# EAGLE design JediLightSwitch-V1.1 (EAGLE 7.4.0)
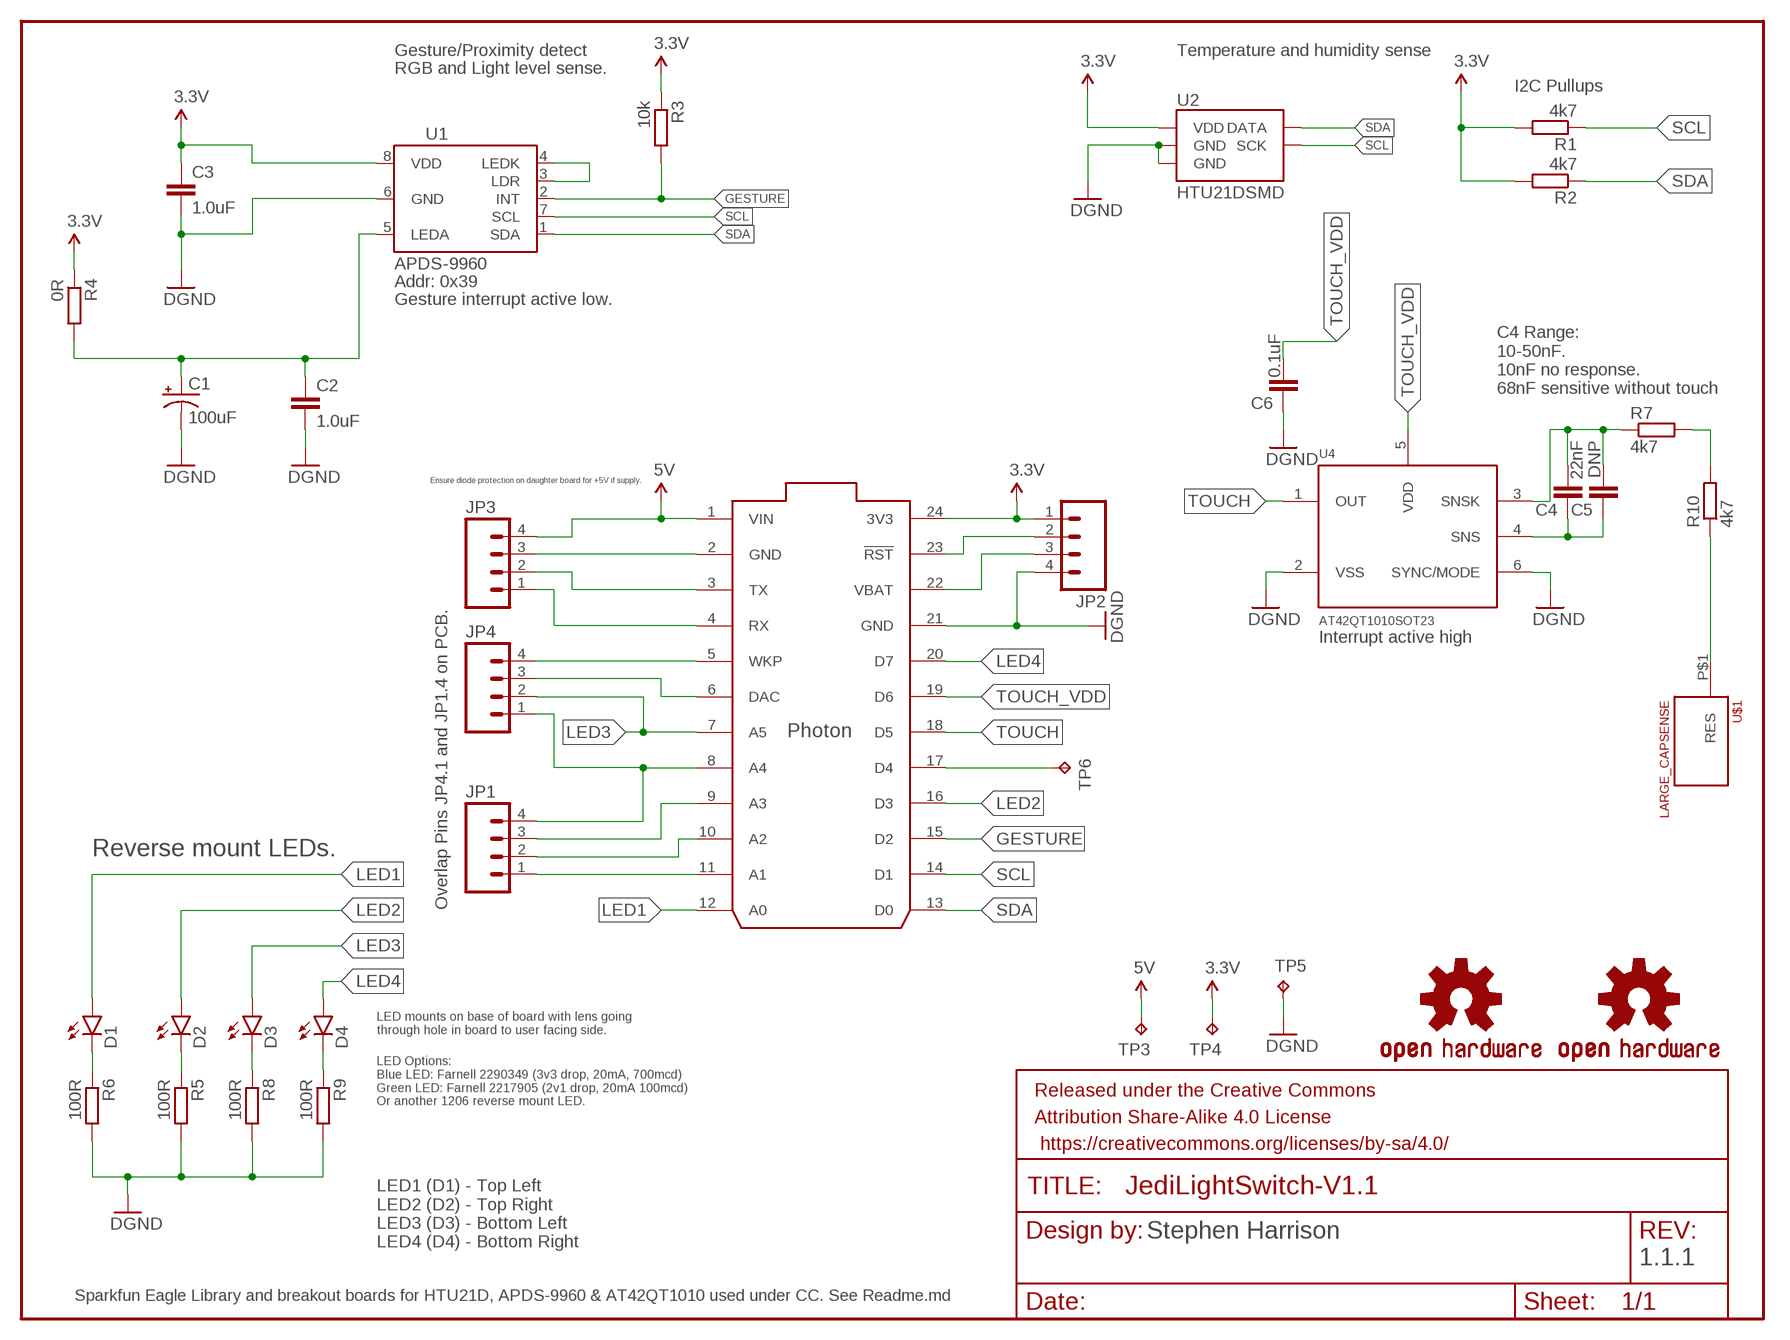
[diagram p0: schematic, sheet 1]

## Parts
C1  100uF  100UF-10V-10%(TANT)  [EIA7343]
C2  1.0uF  C-EUC0805  [C0805]
C3  1.0uF  C-EUC0805  [C0805]
C4  22nF  C-EUC0805  [C0805]
C5  DNP  C-EUC0805  [C0805]
C6  0.1uF  C-EUC0805  [C0805]
D1  LED1206-BOTTOM  [LED-1206-BOTTOM]
D2  LED1206-BOTTOM  [LED-1206-BOTTOM]
D3  LED1206-BOTTOM  [LED-1206-BOTTOM]
D4  LED1206-BOTTOM  [LED-1206-BOTTOM]
FRAME2  FRAME-LETTER  [CREATIVE_COMMONS]
JP1  M04SMD_STRAIGHT_COMBO  [1X04_SMD_STRAIGHT_COMBO]
JP2  M04SMD_STRAIGHT_COMBO  [1X04_SMD_STRAIGHT_COMBO]
JP3  M04SMD_STRAIGHT_COMBO  [1X04_SMD_STRAIGHT_COMBO]
JP4  M04SMD_STRAIGHT_COMBO  [1X04_SMD_STRAIGHT_COMBO]
LOGO1  OSHW-LOGOM  [OSHW-LOGO-M]
LOGO2  OSHW-LOGOM  [OSHW-LOGO-M]
R1  4k7  R-EU_R0805  [R0805]
R2  4k7  R-EU_R0805  [R0805]
R3  10k  R-EU_R0805  [R0805]
R4  0R  R-EU_R0805  [R0805]
R5  100R  R-EU_R0805  [R0805]
R6  100R  R-EU_R0805  [R0805]
R7  4k7  R-EU_R0805  [R0805]
R8  100R  R-EU_R0805  [R0805]
R9  100R  R-EU_R0805  [R0805]
R10  4k7  R-EU_R0805  [R0805]
TP3  TPTP20R  [TP20R]
TP4  3v3  TPTP20R  [TP20R]
TP5  TPTP20R  [TP20R]
TP6  TPTP20R  [TP20R]
U1  APDS-9960  [APDS-9960]
U2  HTU21DSMD  [HTU21D]
U3  PHOTON_SMD  [PHOTON_SMD]
U4  AT42QT1010SOT23  [SOT23-6]
U$1  LARGE_CAPSENSE  [LARGE_CAPSENSE]

## Nets
3.3V: C3.1 JP2.1 R1.2 R2.2 R3.1 R4.1 TP4.TP U1.8(VDD) U2.VDD U3.24(3V3)
5V: JP3.4 TP3.TP U3.1(VIN)
GESTURE: R3.2 U1.2(INT) U3.15(D2)
GND: C1.C(-) C2.2 C3.2 C6.1 JP2.4 JP3.3 R5.2 R6.2 R8.2 R9.2 TP5.TP U1.6(GND) U2.7(GND) U2.GND U3.2(GND) U3.21(GND) U4.2(VSS) U4.6(SYNC/MODE) ; supply symbol labelled DGND
LED1: D1.A U3.12(A0)
LED2: D2.A U3.16(D3)
LED3: D3.A JP4.2 U3.7(A5)
LED4: D4.A U3.20(D7)
N$1: U1.3(LDR) U1.4(LEDK)
N$2: C1.A(+) C2.1 R4.2 U1.5(LEDA)
N$3: D2.C R5.1
N$4: D1.C R6.1
N$5: JP2.2 U3.23(!RST)
N$6: JP1.1 U3.11(A1)
N$7: JP2.3 U3.22(VBAT)
N$8: R7.2 R10.2
N$9: R10.1 U$1.P$1(RES)
N$10: JP4.4 U3.5(WKP)
N$11: JP1.2 U3.10(A2)
N$12: JP1.3 U3.9(A3)
N$13: JP1.4 JP4.1 U3.8(A4)
N$14: JP3.1 U3.4(RX)
N$15: JP3.2 U3.3(TX)
N$16: JP4.3 U3.6(DAC)
N$19: C4.2 C5.2 R7.1 U4.3(SNSK)
N$20: C4.1 C5.1 U4.4(SNS)
N$22: TP6.TP U3.17(D4)
N$30: D3.C R8.1
N$31: D4.C R9.1
SCL: R1.1 U1.7(SCL) U2.SCK U3.14(D1)
SDA: R2.1 U1.1(SDA) U2.DATA U3.13(D0)
TOUCH: U3.18(D5) U4.1(OUT)
TOUCH_VDD: C6.2 U3.19(D6) U4.5(VDD)
Unconnected: U3.25(EN) U3.26(!SETUP) U3.27(RGB_RED) U3.28(RGB_GREEN) U3.29(RGB_BLUE) U3.30(USB_D-) U3.31(USB_D+)

## Notes on the sheet
- Gesture/Proximity detect | Temperature and humidity sense
- RGB and Light level sense.
- I2C Pullups
- Addr: 0x39
- Gesture interrupt active low.
- C4 Range: 
  10-50nF. 
  10nF no response.
  68nF sensitive without touch
- Ensure diode protection on daughter board for +5V if supply.
- Interrupt active high
- Reverse mount LEDs.
- Overlap Pins JP4.1 and JP1.4 on PCB.
- LED mounts on base of board with lens going 
  through hole in board to user facing side.
- LED Options:
  Blue LED: Farnell 2290349 (3v3 drop, 20mA, 700mcd)
  Green LED: Farnell 2217905 (2v1 drop, 20mA 100mcd)
  Or another 1206 reverse mount LED.
- Stephen Harrison
- LED1 (D1) - Top Left
  LED2 (D2) - Top Right
  LED3 (D3) - Bottom Left
  LED4 (D4) - Bottom Right
- 1.1.1
- Sparkfun Eagle Library and breakout boards for HTU21D, APDS-9960 & AT42QT1010 used under CC. See Readme.md

## Library data of the parts
C1 = SparkFun-Capacitors:100UF-10V-10%(TANT): CAP-07890; FARNELL: 1754094; PROD_ID: CAP-07890
C2 C3 = rcl:C-EU: CAPACITOR, European symbol; FARNELL: 2320853
C4 = rcl:C-EU: CAPACITOR, European symbol; FARNELL: 2320841
C5 C6 = rcl:C-EU: CAPACITOR, European symbol
D1-D4 = SparkFun-LED:LED: LEDs Standard schematic elements and footprints for 5mm, 3mm, 1206, and 0603 sized LEDs. 5mm - Spark Fun Electronics SKU : COM-00529 (and others); FARNELL: 2290349
FRAME2 = SparkFun-Aesthetics:FRAME-LETTER: Schematic Frame Standard 8.5x11 US Letter frame
JP1-JP4 = SparkFun-Connectors:M04: Header 4 Standard 4-pin 0.1" header. Use with straight break away headers (SKU : PRT-00116), right angle break away headers (PRT-00553), swiss pins (PRT-00743), machine pins (PRT-00117), and female headers (PRT-00115). Molex polarized connector foot print use with SKU : PRT-08231 with associated crimp pins and housings. 1MM SMD Version SKU: PRT-10208; PROD_ID: CONN-08511; VALUE: 1X04_SMD_STRAIGHT_COMBO
LOGO1 LOGO2 = SparkFun-Aesthetics:OSHW-LOGO: Open Source Hardware Logo This logo indicates the piece of hardware it is found on incorporates a OSHW license and/or adheres to the definition of open source hardware found here: http://freedomdefined.org/OSHW
R1-R10 = rcl:R-EU_: RESISTOR, European symbol
TP3-TP6 = testpad:TP: Test pad
U1 = SparkFun-Sensors:APDS-9960: Avago APDS-9960 digital proximity, ambient light, RGB, and gesture sensor.; FARNELL: 2401098; PROD_ID: SEN-12005
U2 = SparkFun-Sensors:HTU21D; FARNELL: 2393536; PROD_ID: IC-11793
U3 = Particle:PHOTON_SMD: Photon (without headers) - designed to be surface mounted with 7 extra exposed pads on the bottom of the board which include, 3 RGB LED outputs, /SETUP, EN (3.3V SMPS enable input), USB D+ and USB D-.
U4 = SparkFun-DigitalIC:AT42QT1010; FARNELL: 1841593
U$1 = Tinamous:LARGE_CAPSENSE

## Board
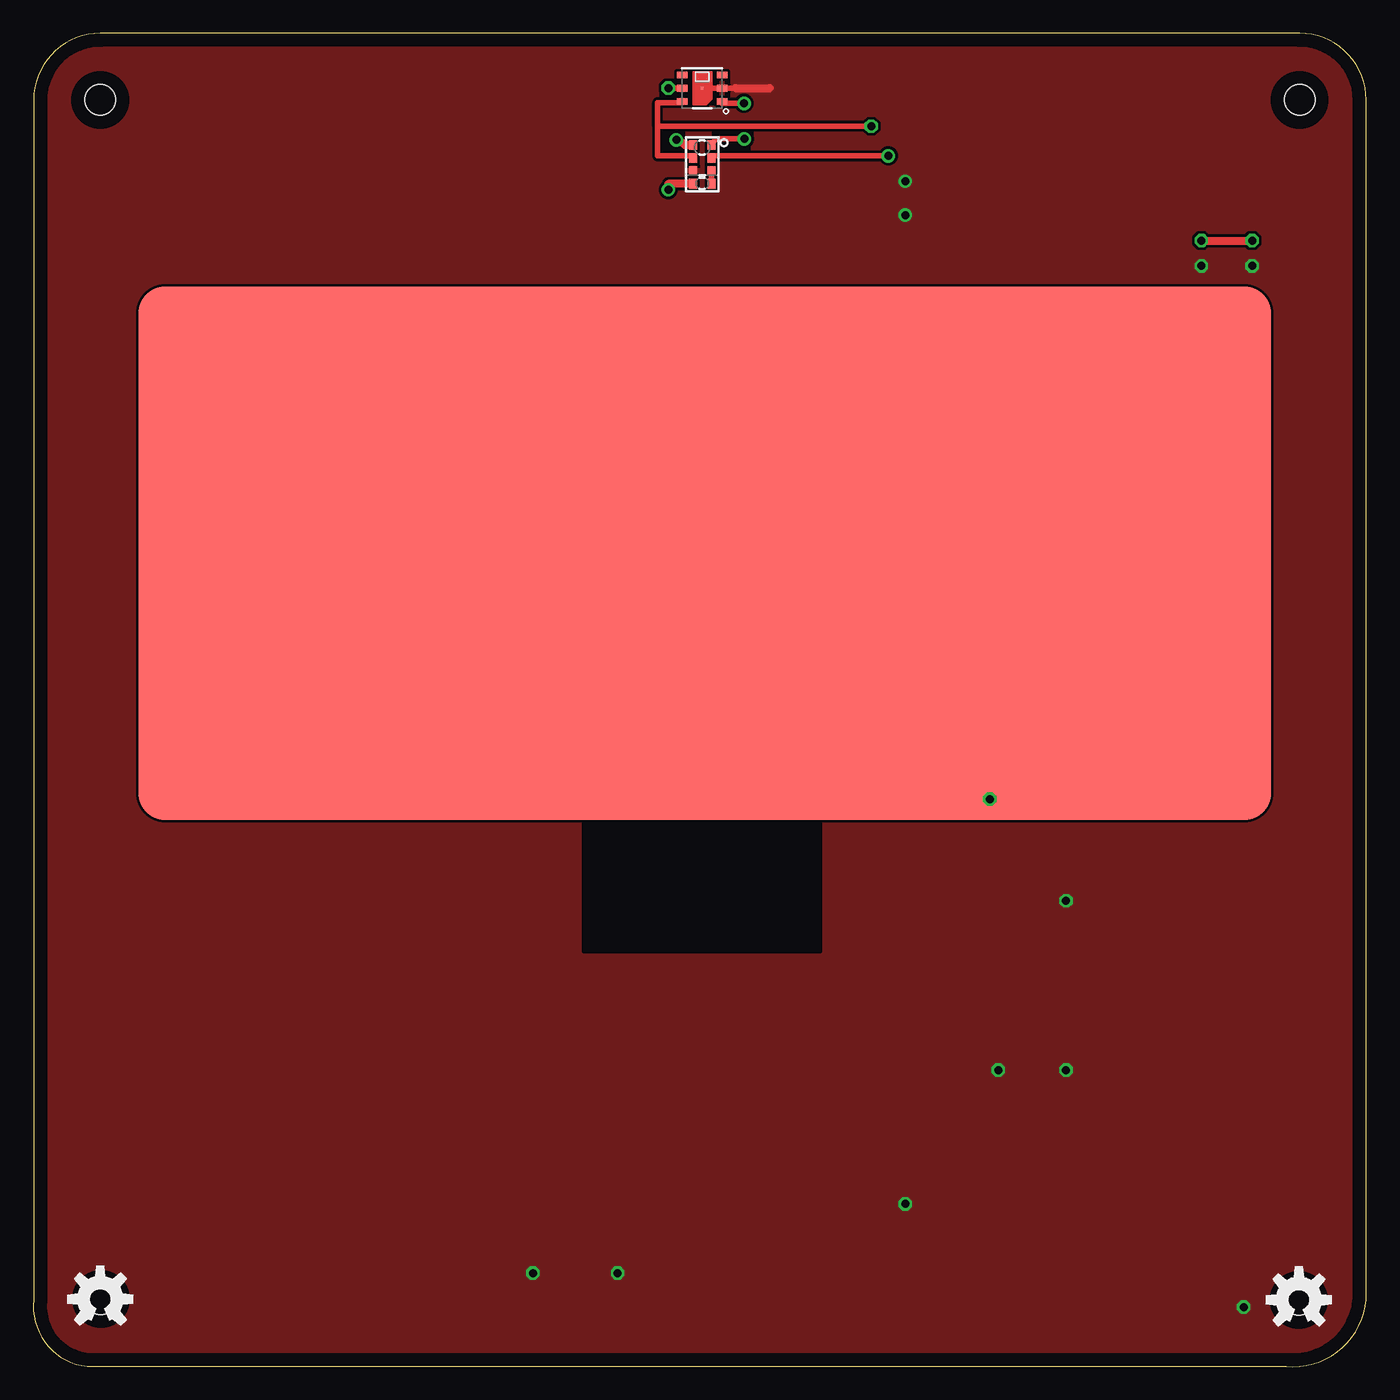
[diagram p1: board, top side]
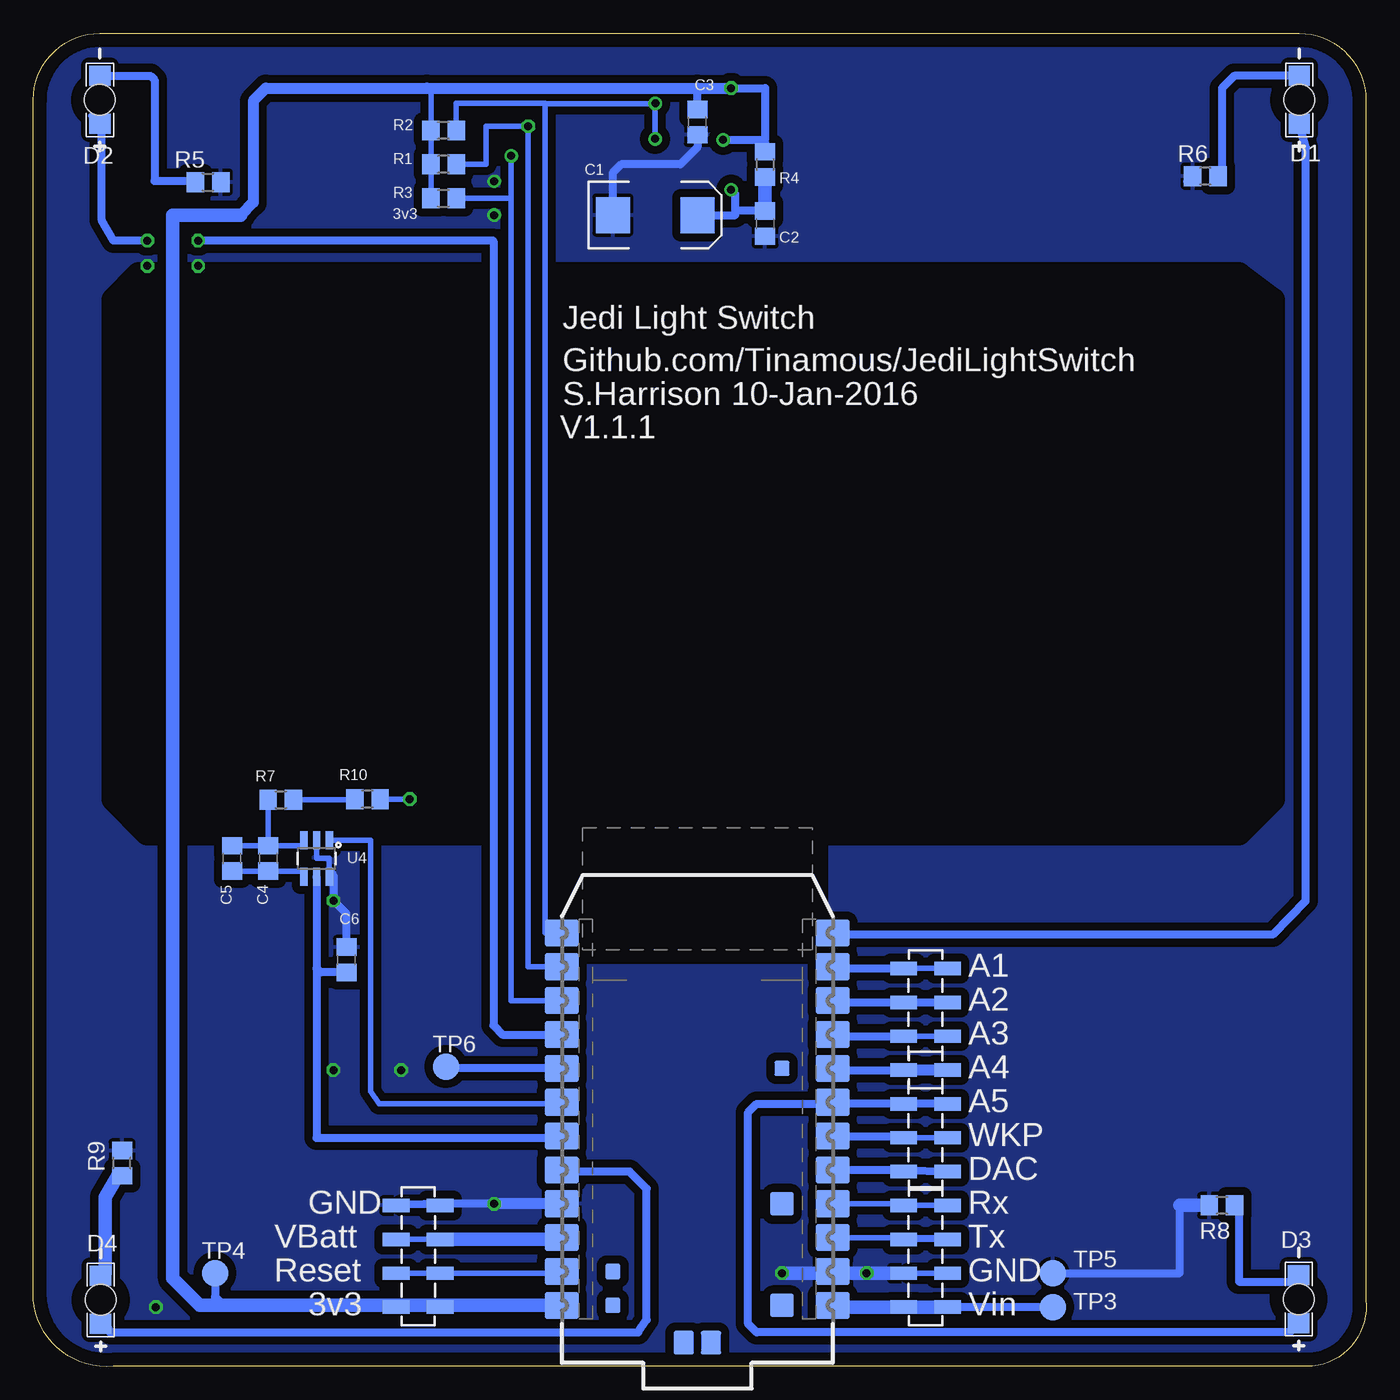
[diagram p2: board, bottom side, seen from below]

Size 100.03 x 100.02 mm. Coordinates in mm from the lower left corner, seen from the top.
Outline: 4.03,0.02 94.03,0.02 arc90 100.03,5.02 100.03,95.02 arc90 95.03,100.02 5.03,100.02 arc90 0.03,95.02 0.03,5.02 arc90 4.03,0.02
Copper layers (1*16): Top 0.035mm / dielectric 1.5mm / Bottom 0.035mm
Design rules "default *": minimum track width 10mil, minimum drill 24mil, track to track 8mil, track to pad 8mil, pad to pad 8mil, via to via 8mil, smd to smd 8mil, copper to edge 40mil, drill to drill 8mil, minimum pad ring 10mil, minimum via ring 8mil, stop-mask expansion 4mil, vias tented up to drill 25mil, thermal gap 10mil
tRestrict: area 41.3,31.1 to 59.1,40.7
bRestrict: area 41.3,31.1 to 59.1,40.7; area 7,40 to 94,81.9

### Footprints (pad centres in the part's own frame; a part is rotated, then mirrored left to right if it is on the bottom)
EIA7343 = smd 2.55 x 2.7: A 3.17,0; C -3.17,0
C0805 = smd 1.3 x 1.5: 1 -0.95,0; 2 0.95,0
LED-1206-BOTTOM = smd 1.5 x 1.6: A -1.8,0; C 1.8,0 | hole 2.3: 0,0
1X04_SMD_STRAIGHT_COMBO = smd 1 x 2: 1 0,-1.65; 1-2 0,1.65; 2 2.54,1.65; 2-2 2.54,-1.65; 3 5.08,-1.65; 3-2 5.08,1.65; 4 7.62,1.65; 4-2 7.62,-1.65
R0805 = smd 1.3 x 1.5: 1 -0.95,0; 2 0.95,0
TP20R = smd 2 x 2: TP 0,0
APDS-9960 = smd 0.6 x 0.72: 1 0.7,1.455; 2 0.7,0.485; 3 0.7,-0.485; 4 0.7,-1.455; 5 -0.7,-1.455; 6 -0.7,-0.485; 7 -0.7,0.485; 8 -0.7,1.455
HTU21D = smd 0.2 x 0.2: 7 0,0 | smd 0.8 x 0.5: DATA 1.5,-1; GND 1.5,0; NC@1 -1.5,1; NC@6 1.5,1; SCK -1.5,-1; VDD -1.5,0
PHOTON_SMD = smd 2.54 x 2.032: 1 0,32.258; 2 0,29.718; 3 0,27.178; 4 0,24.638; 5 0,22.098; 6 0,19.558; 7 0,17.018; 8 0,14.478; 9 0,11.938; 10 0,9.398; 11 0,6.858; 12 0,4.318; 13 20.32,4.318; 14 20.32,6.858; 15 20.32,9.398; 16 20.32,11.938; 17 20.32,14.478; 18 20.32,17.018; 19 20.32,19.558; 20 20.32,22.098; 21 20.32,24.638; 22 20.32,27.178; 23 20.32,29.718; 24 20.32,32.258 | smd 1.778 x 1.778: 25 3.81,32.258; 26 3.81,24.638 | smd 1.143 x 1.143: 27 3.81,14.478; 28 16.51,29.718; 29 16.51,32.258 | smd 1.524 x 1.778: 30 11.176,35.052; 31 9.144,35.052
SOT23-6 = smd 0.55 x 1.35: 1 -0.95,-1.375; 2 0,-1.375; 3 0.95,-1.375; 4 0.95,1.375; 5 0,1.375; 6 -0.95,1.375
LARGE_CAPSENSE = smd 85 x 40: P$1 12.865,17.495

### Placement (x,y rotation side)
C1  53.37,86.38 0 bottom
C2  45.11,85.75 270 bottom
C3  50.19,93.37 270 bottom
C4  82.39,38.12 90 bottom
C5  85.12,38.12 90 bottom
C6  76.53,30.52 270 bottom
D1  5.03,95.03 90 bottom
D2  95.03,95.03 90 bottom
D3  5.07,5.07 90 bottom
D4  94.98,5 90 bottom
FRAME2  18.53,-42.98 0 top  (outside the outline)
JP1  33.05,29.87 270 bottom
JP2  71.15,4.47 90 bottom
JP3  33.05,12.09 270 bottom
JP4  33.05,22.25 270 bottom
LOGO1  94.98,5 0 top
LOGO2  5.03,5.06 0 top
R1  69.24,90.19 180 bottom
R2  69.24,92.73 180 bottom
R3  69.24,87.65 0 bottom
R4  45.11,90.19 270 bottom
R5  86.91,88.86 0 bottom
R6  12.07,89.3 180 bottom
R7  81.45,42.53 0 bottom
R8  10.82,12.09 180 bottom
R9  93.37,15.26 90 bottom
R10  74.96,42.57 180 bottom
TP3  23.52,4.47 0 bottom
TP4  86.39,7.01 0 bottom
TP5  23.52,7.01 0 bottom
TP6  69.06,22.5 0 bottom
U1  50.19,90.19 0 top
U2  50.19,95.91 0 top
U3  40.03,36.85 180 bottom
U4  78.77,38.12 180 bottom
U$1  37.53,43.52 0 top

### Tracks (layer width: path | path; a pad name or v marks a point on that pad's centre or on a via)
3.3V  (via drill 0.6)
  Top 0.406: U2.VDD v47.65,95.91
  Top 0.61: v48.26,92.02 48.9,91.65 U1.8
  Bottom 0.406: 60.86,4.47 U3.24 60.35,4.47 JP2.1 | R2.2 R1.2 R3.1 70.19,95.59 70.51,95.91
  Bottom 0.61: 45.11,92.1 45.11,95.91 v47.65,95.91 | v48.26,92.02 45.19,92.02 45.11,92.1 | R4.1 45.11,91.78 45.11,92.1 | TP4.TP 86.39,5.23 85.75,4.59 | C3.1 50.19,95.91
  Bottom 0.813: v47.65,95.91 50.19,95.91 70.51,95.91 82.58,95.91 83.53,94.95 83.53,87.34 84.48,86.38
  Bottom 1.016: U3.24 85.75,4.59 87.53,4.59 89.56,6.63 89.56,59.71 89.56,83.84 89.56,85.75 89.56,86.38 84.48,86.38
5V
  Bottom 0.406: 31.59,4.59 JP3.4 31.78,4.47 31.78,4.59
  Bottom 0.61: TP3.TP JP3.4
  Bottom 1.016: U3.1 39.4,4.47 JP3.4
GESTURE  (via drill 0.6)
  Top 0.406: U1.2 50.89,90.83 v64.16,90.83
  Bottom 0.406: 64.16,87.65 64.16,27.45 U3.15 | 64.16,87.65 v64.16,90.83 | R3.2 64.16,87.65
GND  (via drill 0.6)
  Top 0.406: 52.73,95.91 U2.GND U2.7
  Top 0.61: 52.73,95.91 55.27,95.91
  Bottom 0.406: U4.2 78.77,38.12 77.82,38.12 U4.6 77.5,37.06 77.5,36.85 | 60.22,12.09 U3.21
  Bottom 0.61: 77.5,36.85 v77.5,34.95 76.53,33.98 C6.1 | v65.43,12.21 69.75,12.21 JP2.4 | 40.16,7.01 U3.2 | TP5.TP 14,7.01 14,12.09 | 13.43,88.89 R6.2 | C3.2 50.19,91.46 51.46,90.19 55.91,90.19 56.54,89.56 C1.C
  Bottom 0.813: U3.21 v65.43,12.21
  Bottom 1.016: R8.2 14,12.09 | v43.84,7.01 40.16,7.01 | U3.2 39.4,7.01 v37.49,7.01 JP3.3
  other vias: 72.42,22.25 77.5,22.25 87.66,82.57 91.47,82.57 65.43,88.92 65.43,86.38 90.83,4.47
  pour Top: -1.24,101.62 100.99,101.62 101.63,-2.72 -2.51,-2.52
  pour Bottom (isolate 0.61, rank 5): -1.24,100.35 -1.24,-1.25 97.18,-0.61 101.63,5.74 102.26,99.72 100.99,100.99 -0.61,100.99
LED1
  Bottom 0.61: D1.A 4.53,91.46 4.55,83.32 4.55,34.94 7.01,32.41 39.4,32.41 U3.12
LED2  (via drill 0.6)
  Top 0.61: v87.66,84.48 v91.47,84.48
  Bottom 0.406: D2.A 95.73,93.83 | 61.03,25.02 60.92,24.91 U3.16
  Bottom 0.61: 60.92,24.91 64.81,24.91 65.5,25.6 65.5,84.44 65.54,84.48 v87.66,84.48 | v91.47,84.48 94.01,84.48 94.89,86 94.89,93.09 D2.A
LED3
  Bottom 0.61: D3.A 5.11,3.27 5.11,3.2 5.74,2.56 45.75,2.56 46.38,3.2 46.38,19.07 45.75,19.71 40.16,19.71 U3.7 39.9,19.71 JP4.2
LED4
  Bottom 0.406: 60.99,14.63 60.86,14.75 U3.20
  Bottom 0.61: D4.A 94.57,3.2 94.26,2.56 54.64,2.56 54,3.5 54,13.36 55.27,14.63 60.22,14.63 U3.20
N$1
  Top 0.406: U1.4 U1.3
N$2  (via drill 0.6)
  Top 0.61: U1.5 47.65,88.74 v47.65,88.29
  Bottom 0.61: C2.1 47.33,86.7 | 47.33,86.7 47.33,86.38 C1.A | 47.33,86.7 47.33,87.97 v47.65,88.29
  Bottom 1.016: R4.2 C2.1
N$3
  Bottom 0.61: D2.C 91.23,96.83 90.93,96.54 90.93,88.96 87.95,88.96 R5.1
N$4
  Bottom 0.61: D1.C 9.9,96.83 10.82,95.91 10.82,88.97 R6.1
N$5
  Bottom 0.406: JP2.2 60.35,7.01 U3.23
N$6
  Bottom 0.61: U3.11 39.4,29.87 JP1.1
N$7
  Bottom 1.016: JP2.3 60.48,9.55 U3.22
N$8
  Bottom 0.406: R7.2 75.95,42.52 R10.2
  Bottom 0.61: 76.23,42.89 R10.2
N$9  (via drill 0.6)
  Top 0.406: v71.78,42.57 68.84,42.57 U$1.P$1
  Bottom 0.406: R10.1 v71.78,42.57
N$10
  Bottom 0.61: U3.5 34.7,14.75 JP4.4
N$11
  Bottom 0.61: U3.10 39.4,27.33 JP1.2
N$12
  Bottom 0.61: U3.9 39.08,24.79 JP1.3
N$13
  Bottom 0.61: U3.8 39.4,22.25 JP4.1
  Bottom 0.813: JP1.4 JP4.1
N$14
  Bottom 0.406: U3.4 34.89,12.21 JP3.1
N$15
  Bottom 0.406: U3.3 31.52,9.67 JP3.2
N$16
  Bottom 0.61: U3.6 34.19,17.29 JP4.3
N$19
  Bottom 0.406: U4.3 79.72,39.08 81.94,39.08 81.94,39.07 C4.2 | C4.2 82.39,39.12 R7.1 | C5.2 C4.2
N$20
  Bottom 0.406: U4.4 79.72,37.17 82.25,37.17 C4.1 C5.1
N$22
  Bottom 0.61: U3.17 68.94,22.37 TP6.TP
N$30
  Bottom 0.61: R8.1 9.55,12.09 9.55,6.37 5.57,6.37 D3.C
N$31
  Bottom 0.61: 93.69,14.31 R9.1
  Bottom 1.016: D4.C 94.64,7.01 94.64,12.72 93.69,14.31
SCL  (via drill 0.6)
  Top 0.406: v62.89,93.05 46.86,93.05 | 46.86,93.05 46.86,94.82 48.69,94.82 U2.SCK | 46.86,93.05 46.86,90.82 49.49,90.82 U1.7
  Bottom 0.406: U3.14 62.89,29.99 v62.89,93.05 66.07,93.05 66.07,90.19 R1.1
SDA  (via drill 0.6)
  Top 0.406: v53.34,94.76 53.37,94.64 53.37,94.76 51.69,94.76 U2.DATA | U1.1 50.89,91.72 51.27,92.1 v53.37,92.1
  Bottom 0.406: U3.13 61.62,32.53 61.62,94.64 | 61.62,94.64 61.62,94.76 68.29,94.76 R2.1 | 53.37,94.74 v53.34,94.76 | 53.37,94.74 61.52,94.74 61.62,94.64 | 53.37,94.74 v53.37,92.1
TOUCH
  Bottom 0.406: U3.18 60.35,19.71 74.09,19.71 74.73,20.66 74.73,39.5 U4.1
TOUCH_VDD
  Bottom 0.406: 60.35,17.17 U3.19
  Bottom 0.61: U4.5 78.77,29.87 | 78.77,29.87 78.77,17.17 60.35,17.17 | C6.2 78.47,29.57 78.77,29.87

### Text on the board
bNames: 3v3 | Jedi Light Switch | Github.com/Tinamous/JediLightSwitch | S.Harrison 10-Jan-2016 | V1.1.1 | A1 | A2 | A3 | A4 | A5 | WKP | DAC | Rx | GND | Tx | VBatt | GND | Reset | Vin | 3v3